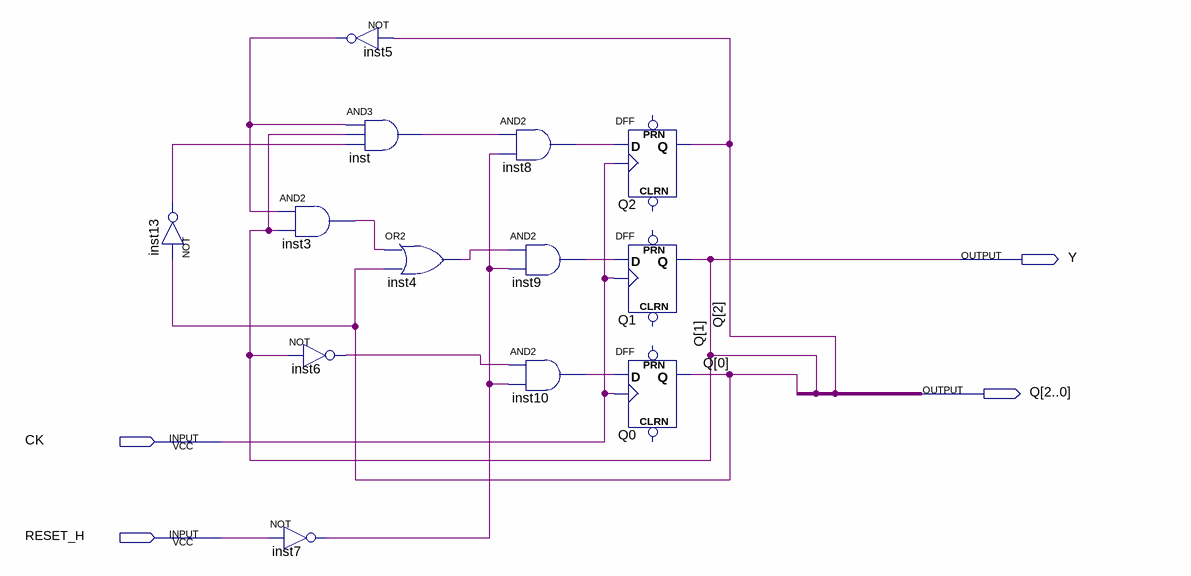
[diagram p0: schematic sheet]
// Quartus schematic MEF.bdf as structural Verilog: 13 symbols, 4 pins
module MEF (
  input  CK,
  input  RESET_H,
  output Y,
  output [2:0] Q
);

  wire inst3_out, inst4_out, inst5_out, inst6_out, inst7_out, inst8_out, inst9_out, inst10_out, inst13_out,
       inst_out;

  not inst13 (inst13_out, Q[0]);
  and inst3 (inst3_out, inst5_out, Q[1]);
  not inst7 (inst7_out, RESET_H);
  not inst5 (inst5_out, Q[2]);
  and inst (inst_out, inst5_out, Q[1], inst13_out);
  not inst6 (inst6_out, Q[1]);
  or inst4 (inst4_out, inst3_out, Q[0]);
  and inst8 (inst8_out, inst_out, inst7_out);
  and inst9 (inst9_out, inst4_out, inst7_out);
  and inst10 (inst10_out, inst6_out, inst7_out);
  DFF Q2 (.CLK(CK), .D(inst8_out), .Q(Q[2]));  // open: CLRN, PRN
  DFF Q1 (.CLK(CK), .D(inst9_out), .Q(Q[1]));  // open: CLRN, PRN
  DFF Q0 (.CLK(CK), .D(inst10_out), .Q(Q[0]));  // open: CLRN, PRN

  assign Y = Q[1];
endmodule
